# Altium schematic sheet ISL91107.SchDoc
size A4; SheetNumber: 6; SheetTotal: 7
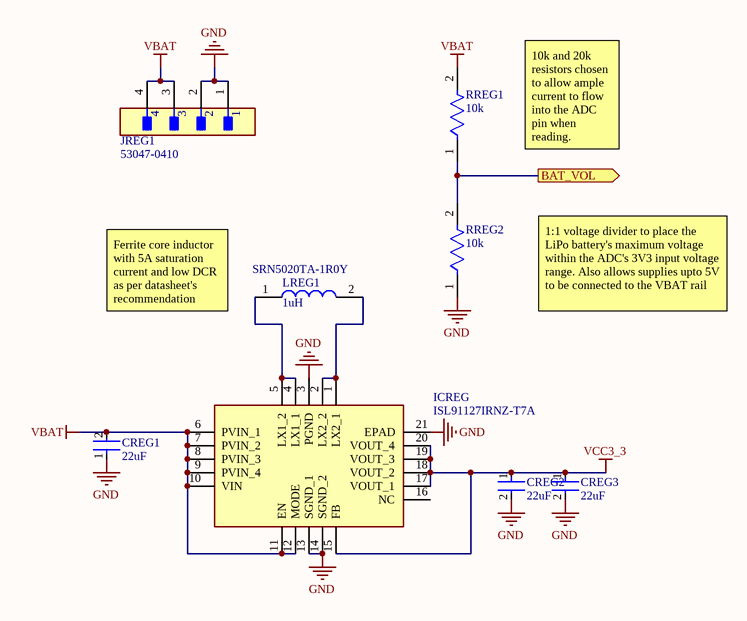
[diagram p0: ISL91107.SchDoc]

## Parts
CREG1  22uF  [FP-GRM188-0_2-IPC_C]
CREG2  22uF  [FP-GRM188-0_2-IPC_C]
CREG3  22uF  [FP-GRM188-0_2-IPC_C]
ICREG  ISL91127IRNZ-T7A  [QFN50P400X400X100-21N]
JREG1  53047-0410  [FP-53047-0410-MFG]
LREG1  1uH  [INDC5050X200N]
RREG1  10k  [FP-ERJ3G-IPC_C]
RREG2  10k  [FP-ERJ3G-IPC_C]

## Ports
BAT_VOL (out)

## Nets
GND: CREG1.1 CREG2.2 CREG3.2 ICREG.3(PGND) ICREG.13(SGND_1) ICREG.14(SGND_2) ICREG.21(EPAD) JREG1.1 JREG1.2 RREG2.1
VBAT: CREG1.2 ICREG.6(PVIN_1) ICREG.7(PVIN_2) ICREG.8(PVIN_3) ICREG.9(PVIN_4) ICREG.10(VIN) ICREG.11(EN) ICREG.12(MODE) JREG1.3 JREG1.4 RREG1.2
VCC3_3: CREG2.1 CREG3.1 ICREG.15(FB) ICREG.17(VOUT_1) ICREG.18(VOUT_2) ICREG.19(VOUT_3) ICREG.20(VOUT_4)
BAT_VOL: RREG1.1 RREG2.2 ; port BAT_VOL
NetICREG_1: ICREG.1(LX2_1) ICREG.2(LX2_2) LREG1.2
NetICREG_4: ICREG.4(LX1_1) ICREG.5(LX1_2) LREG1.1

Not connected (* = marked no-connect by the designer): ICREG 16(NC)

## Notes on the sheet
- 10k and 20k resistors chosen to allow ample current to flow into the ADC pin when reading.
  QREG1 closes the path when the ADC is not in use to reduce leakage current
- Ferrite core inductor with 5A saturation current and low DCR as per datasheet's recommendation
- 1:1 voltage divider to place the LiPo battery's maximum voltage within the ADC's 3V3 input voltage range. Also allows supplies upto 5V to be connected to the VBAT rail

## Library data of the parts
CREG1-CREG3 = CMP-2000-06337-3: Chip Multilayer Ceramic Capacitors for General Purpose, 0603, 22uF, X5R, 15%, 20%, 10V; Tolerance: 20%; Weight: 0.000222oz; Material: Ceramic; Depth: 0.8mm; Length: 1.6mm; Termination: SMD/SMT; Capacitance: 22uF; Packaging: Tape and Reel; Width: 0.8mm; Voltage Rating: 10V; Case Code (Imperial): 0603; Mount: Surface Mount; Voltage Rating (DC): 10V; Case/Package: 0603; Thickness: 0.039inch; REACH SVHC: No SVHC; Dielectric: X5R; Height: 0.8mm; Package Quantity: 4000; Case Code (Metric): 1608; Min Operating Temperature: -55°C; Lead Free: Lead Free; Max Operating Temperature: 85°C
ICREG = ISL91127IRNZ-T7A: Integrated Circuit; Manufacturer_Name: Renesas Electronics; Datasheet Link: https://www.renesas.com/en-us/www/doc/datasheet/isl91127ir.pdf; Height: 1mm; Manufacturer_Part_Number: ISL91127IRNZ-T7A; Mouser Part Number: 968-ISL91127IRNZ-T7A; Mouser Price/Stock: https://www.mouser.co.uk/ProductDetail/Renesas-Intersil/ISL91127IRNZ-T7A?qs=MbhLeWKW1It6pBrhIpi7Yg%3D%3D; Supplier 1: Mouser; Supplier Part Number 1: 968-ISL91127IRNZ-T7A
JREG1 = CMP-04776-000321-1: CONN HEADER VERT 4POS 1.25MM; Plating: Tin; Number of Positions: 4; Voltage Rating (AC): 125V; Insulation Resistance: 100MR; Current Rating: 1A; Glow Wire Compliant: Non-compliant; Contact Resistance: 20mR; Gender: Male; Series: PicoBlade; Contact Material: Bronze; Number of Circuits: 4; Voltage Rating (DC): 125V; Working Voltage: 125V; Termination: Solder; Pitch: 1.25mm; Housing Material: Polyamide; Orientation: Vertical; Current: 1A; Flammability Rating: UL94 V-0; Max Voltage Rating (AC): 125V; Housing Color: Natural; Package Quantity: 5000; Mount: Through Hole; Case/Package: 0410; Max Operating Temperature: 85°C; RoHS Compliant: Yes; Voltage Rating: 125V; Lead Free: Lead Free; Packaging: Tray; Color: Natural; Contact Plating: Tin; Number of Rows: 1; Radiation Hardening: No; Min Operating Temperature: -40°C; Voltage: 125V; Number of Contacts: 4
LREG1 = SRN5020TA-1R0Y: Inductor; Manufacturer_Name: Bourns; Datasheet Link: https://www.mouser.com/datasheet/2/54/bourns_09242018_SRN5020TA_datasheet-1483446.pdf; Height: 2mm; Manufacturer_Part_Number: SRN5020TA-1R0Y; Mouser Part Number: 652-SRN5020TA-1R0Y; Mouser Price/Stock: https://www.mouser.co.uk/ProductDetail/Bourns/SRN5020TA-1R0Y?qs=qSfuJ%252Bfl%2Fd5ZUICL%252BTn9FA%3D%3D; Arrow Part Number: SRN5020TA-1R0Y; Arrow Price/Stock: https://www.arrow.com/en/products/srn5020ta-1r0y/bourns?region=nac; Supplier 1: Arrow Electronics; Supplier Part Number 1: SRN5020TA-1R0Y
RREG1 RREG2 = CMP-2000-00704-2: RES SMD 10K OHM 5% 1/10W 0603; Temperature Coefficient: 200ppm/°C; Max Power Dissipation: 100mW; Resistance: 10kR; Voltage Rating (DC): 50V; Voltage Rating: 75V; Resistor Type: Thick Film; Tolerance: 5%; Military Standard: Not; Package Quantity: 1; Max Operating Temperature: 155°C; Mount: Surface Mount; Technology: THICK FILM; Case/Package: 0603; Construction: Rectangular; Depth: 0.8mm; Case Code (Imperial): 0603; Weight: 7.1E-05oz; Features: Automotive AEC-Q200; Packaging: Tape and Reel; Width: 0.8mm; Length: 1.6mm; Termination: SMD/SMT; Power Rating: 100mW; Lead Free: Lead Free; Number of Terminations: 2; Height: 0.45mm; RoHS Compliant: Yes; Min Operating Temperature: -55°C; Contact Plating: Tin; REACH SVHC: No SVHC; Resistance Tolerance: 5%; Series: ERJ; Working Voltage: 75V; Case Code (Metric): 1608